# EAGLE schematic BRD1001-003-320 - Switchboard (EAGLE 9.4.2)
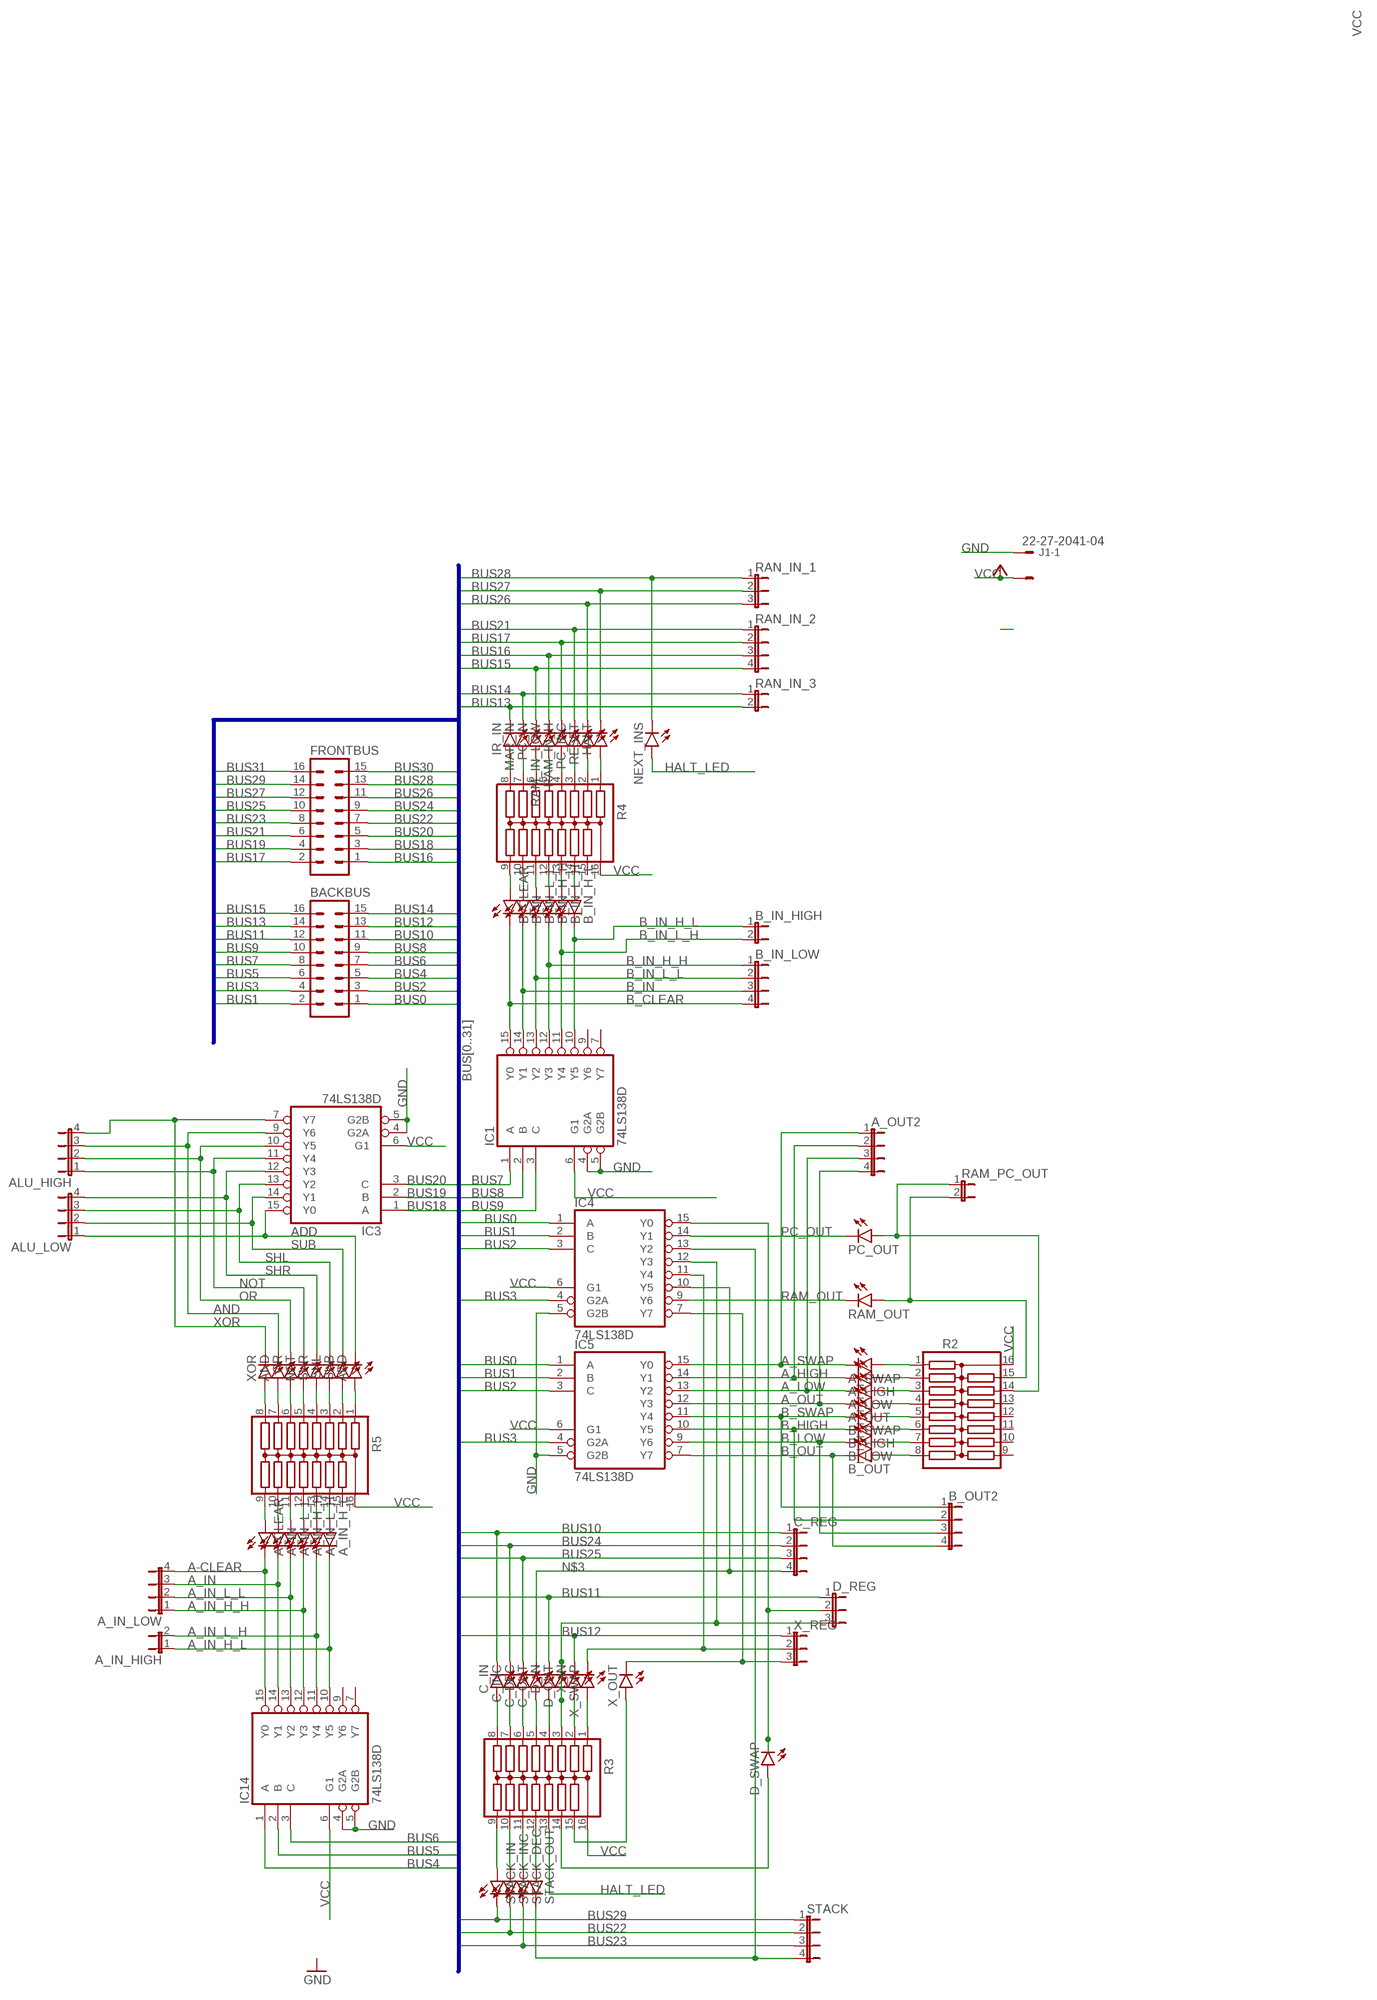
[diagram p0: schematic, sheet 1]

## Parts
A_CLEAR  LEDSFH482  [SFH482]
A_HIGH  LEDSFH482  [SFH482]
A_IN  LEDSFH482  [SFH482]
A_IN_H_H  LEDSFH482  [SFH482]
A_IN_H_L  LEDSFH482  [SFH482]
A_IN_HIGH  JP1E  [JP1]
A_IN_L_H  LEDSFH482  [SFH482]
A_IN_L_L  LEDSFH482  [SFH482]
A_IN_LOW  JP4E  [JP4]
A_LOW  LEDSFH482  [SFH482]
A_OUT  LEDSFH482  [SFH482]
A_OUT2  JP4E  [JP4]
A_SWAP  LEDSFH482  [SFH482]
ADD  LEDSFH482  [SFH482]
ALU_HIGH  JP4E  [JP4]
ALU_LOW  JP4E  [JP4]
AND  LEDSFH482  [SFH482]
B_CLEAR  LEDSFH482  [SFH482]
B_HIGH  LEDSFH482  [SFH482]
B_IN  LEDSFH482  [SFH482]
B_IN_H_H  LEDSFH482  [SFH482]
B_IN_H_L  LEDSFH482  [SFH482]
B_IN_HIGH  JP1E  [JP1]
B_IN_L_H  LEDSFH482  [SFH482]
B_IN_L_L  LEDSFH482  [SFH482]
B_IN_LOW  JP4E  [JP4]
B_LOW  LEDSFH482  [SFH482]
B_OUT  LEDSFH482  [SFH482]
B_OUT2  JP4E  [JP4]
B_SWAP  LEDSFH482  [SFH482]
BACKBUS  ML16  [ML16]
C_DEC  LEDSFH482  [SFH482]
C_IN  LEDSFH482  [SFH482]
C_INC  LEDSFH482  [SFH482]
C_OUT  LEDSFH482  [SFH482]
C_REG  JP4E  [JP4]
D_IN  LEDSFH482  [SFH482]
D_OUT  LEDSFH482  [SFH482]
D_REG  JP2W  [JP2W]
D_SWAP  LEDSFH482  [SFH482]
FRONTBUS  ML16  [ML16]
HALT  LEDSFH482  [SFH482]
IC1  74LS138D  [SO16]
IC3  74LS138D  [SO16]
IC4  74LS138D  [SO16]
IC5  74LS138D  [SO16]
IC14  74LS138D  [SO16]
IR_IN  LEDSFH482  [SFH482]
J1  22-27-2041-04  [6410-04]
MAR_IN  LEDSFH482  [SFH482]
NEXT_INS  LEDSFH482  [SFH482]
NOT  LEDSFH482  [SFH482]
OR  LEDSFH482  [SFH482]
PC_IN  LEDSFH482  [SFH482]
PC_INC  LEDSFH482  [SFH482]
PC_OUT  LEDSFH482  [SFH482]
R2  2NBS16-15  [SO16]
R3  2NBS16-15  [SO16]
R4  2NBS16-15  [SO16]
R5  2NBS16-15  [SO16]
RAM_IN_H  LEDSFH482  [SFH482]
RAM_IN_LOW  LEDSFH482  [SFH482]
RAM_OUT  LEDSFH482  [SFH482]
RAM_PC_OUT  JP1E  [JP1]
RAN_IN_1  JP2W  [JP2W]
RAN_IN_2  JP4E  [JP4]
RAN_IN_3  JP1E  [JP1]
RESET  LEDSFH482  [SFH482]
SHL  LEDSFH482  [SFH482]
SHR  LEDSFH482  [SFH482]
STACK  JP4E  [JP4]
STACK_DEC  LEDSFH482  [SFH482]
STACK_IN  LEDSFH482  [SFH482]
STACK_INC  LEDSFH482  [SFH482]
STACK_OUT  LEDSFH482  [SFH482]
SUB  LEDSFH482  [SFH482]
X_IN  LEDSFH482  [SFH482]
X_OUT  LEDSFH482  [SFH482]
X_REG  JP2W  [JP2W]
X_SWAP  LEDSFH482  [SFH482]
XOR  LEDSFH482  [SFH482]

## Nets
A-CLEAR: A_CLEAR.K(C) A_IN_LOW.4 IC14.15(Y0)
A_HIGH: A_HIGH.K(C) A_OUT2.2 IC5.14(Y1)
A_IN: A_IN.K(C) A_IN_LOW.3 IC14.14(Y1)
A_IN_H_H: A_IN_H_H.K(C) A_IN_LOW.1 IC14.12(Y3)
A_IN_H_L: A_IN_H_L.K(C) A_IN_HIGH.1 IC14.10(Y5)
A_IN_L_H: A_IN_HIGH.2 A_IN_L_H.K(C) IC14.11(Y4)
A_IN_L_L: A_IN_L_L.K(C) A_IN_LOW.2 IC14.13(Y2)
A_LOW: A_LOW.K(C) A_OUT2.3 IC5.13(Y2)
A_OUT: A_OUT2.4 A_OUT.K(C) IC5.12(Y3)
A_SWAP: A_OUT2.1 A_SWAP.K(C) IC5.15(Y0)
ADD: ADD.K(C) ALU_LOW.1 IC3.15(Y0)
AND: ALU_HIGH.3 AND.K(C) IC3.9(Y6)
B_CLEAR: B_CLEAR.K(C) B_IN_LOW.4 IC1.15(Y0)
B_HIGH: B_HIGH.K(C) B_OUT2.2 IC5.10(Y5)
B_IN: B_IN.K(C) B_IN_LOW.3 IC1.14(Y1)
B_IN_H_H: B_IN_H_H.K(C) B_IN_LOW.1 IC1.12(Y3)
B_IN_H_L: B_IN_H_L.K(C) B_IN_HIGH.1 IC1.10(Y5)
B_IN_L_H: B_IN_HIGH.2 B_IN_L_H.K(C) IC1.11(Y4)
B_IN_L_L: B_IN_L_L.K(C) B_IN_LOW.2 IC1.13(Y2)
B_LOW: B_LOW.K(C) B_OUT2.3 IC5.9(Y6)
B_OUT: B_OUT2.4 B_OUT.K(C) IC5.7(Y7)
B_SWAP: B_OUT2.1 B_SWAP.K(C) IC5.11(Y4)
BUS0: BACKBUS.1 IC4.1(A) IC5.1(A)
BUS1: BACKBUS.2 IC4.2(B) IC5.2(B)
BUS2: BACKBUS.3 IC4.3(C) IC5.3(C)
BUS3: BACKBUS.4 IC4.4(G2A) IC5.4(G2A)
BUS4: BACKBUS.5 IC14.1(A)
BUS5: BACKBUS.6 IC14.2(B)
BUS6: BACKBUS.7 IC14.3(C)
BUS7: BACKBUS.8 IC1.1(A)
BUS8: BACKBUS.9 IC1.2(B)
BUS9: BACKBUS.10 IC1.3(C)
BUS10: BACKBUS.11 C_IN.K(C) C_REG.1
BUS11: BACKBUS.12 D_IN.K(C) D_REG.1
BUS12: BACKBUS.13 X_IN.K(C) X_REG.1
BUS13: BACKBUS.14 IR_IN.K(C) RAN_IN_3.2
BUS14: BACKBUS.15 MAR_IN.K(C) RAN_IN_3.1
BUS15: BACKBUS.16 PC_IN.K(C) RAN_IN_2.4
BUS16: FRONTBUS.1 RAM_IN_LOW.K(C) RAN_IN_2.3
BUS17: FRONTBUS.2 RAM_IN_H.K(C) RAN_IN_2.2
BUS18: FRONTBUS.3 IC3.1(A)
BUS19: FRONTBUS.4 IC3.2(B)
BUS20: FRONTBUS.5 IC3.3(C)
BUS21: FRONTBUS.6 PC_INC.K(C) RAN_IN_2.1
BUS22: FRONTBUS.7 STACK.2 STACK_INC.K(C)
BUS23: FRONTBUS.8 STACK.3 STACK_DEC.K(C)
BUS24: C_INC.K(C) C_REG.2 FRONTBUS.9
BUS25: C_DEC.K(C) C_REG.3 FRONTBUS.10
BUS26: FRONTBUS.11 RAN_IN_1.3 RESET.K(C)
BUS27: FRONTBUS.12 HALT.K(C) RAN_IN_1.2
BUS28: FRONTBUS.13 NEXT_INS.K(C) RAN_IN_1.1
BUS29: FRONTBUS.14 STACK.1 STACK_IN.K(C)
BUS30: FRONTBUS.15
BUS31: FRONTBUS.16
GND: IC1.4(G2A) IC1.5(G2B) IC3.4(G2A) IC3.5(G2B) IC4.5(G2B) IC5.5(G2B) IC14.4(G2A) IC14.5(G2B) J1.1
HALT_LED: NEXT_INS.A R3.13
N$2: C_IN.A R3.8
N$3: C_OUT.K(C) C_REG.4 IC4.10(Y5)
N$4: C_OUT.A R3.5
N$5: C_DEC.A R3.6
N$6: C_INC.A R3.7
N$7: D_OUT.A D_OUT.K(C) D_REG.3 IC4.12(Y3) R3.3
N$8: D_IN.A R3.4
N$9: R3.1 X_SWAP.A
N$10: IC4.11(Y4) X_REG.2 X_SWAP.K(C)
N$11: R3.2 X_IN.A
N$12: IC4.7(Y7) X_OUT.K(C) X_REG.3
N$13: R3.15 X_OUT.A
N$14: R3.9 STACK_IN.A
N$15: R3.10 STACK_INC.A
N$16: R3.11 STACK_DEC.A
N$17: R3.12 STACK_OUT.A
N$18: IC4.13(Y2) STACK.4 STACK_OUT.K(C)
N$19: D_REG.2 D_SWAP.K(C) IC4.15(Y0)
N$20: D_SWAP.A R3.14
N$21: A_CLEAR.A R5.9
N$22: ADD.A R5.1
N$23: A_IN.A R5.10
N$24: B_CLEAR.A R4.9
N$25: B_IN.A R4.10
N$26: B_IN_L_L.A R4.11
N$27: B_IN_H_H.A R4.12
N$28: R5.8 XOR.A
N$29: AND.A R5.7
N$30: OR.A R5.6
N$31: NOT.A R5.5
N$32: R5.4 SHR.A
N$33: R5.3 SHL.A
N$34: R5.2 SUB.A
N$35: B_IN_L_H.A R4.13
N$36: B_IN_H_L.A R4.14
N$38: A_IN_L_L.A R5.11
N$39: A_IN_H_H.A R5.12
N$40: A_IN_L_H.A R5.13
N$41: A_IN_H_L.A R5.14
N$44: R2.15 RAM_OUT.A RAM_PC_OUT.2
N$45: A_SWAP.A R2.1
N$46: A_HIGH.A R2.2
N$47: A_LOW.A R2.3
N$48: A_OUT.A R2.4
N$49: B_SWAP.A R2.5
N$51: B_HIGH.A R2.6
N$52: B_LOW.A R2.7
N$53: B_OUT.A R2.8
N$54: PC_OUT.A R2.14 RAM_PC_OUT.1
N$55: IR_IN.A R4.8
N$56: MAR_IN.A R4.7
N$57: PC_IN.A R4.6
N$58: R4.5 RAM_IN_LOW.A
N$59: R4.4 RAM_IN_H.A
N$60: PC_INC.A R4.3
N$61: R4.2 RESET.A
N$62: HALT.A R4.1
NOT: ALU_HIGH.1 IC3.11(Y4) NOT.K(C)
OR: ALU_HIGH.2 IC3.10(Y5) OR.K(C)
PC_OUT: IC4.14(Y1) PC_OUT.K(C)
RAM_OUT: IC4.9(Y6) RAM_OUT.K(C)
SHL: ALU_LOW.3 IC3.13(Y2) SHL.K(C)
SHR: ALU_LOW.4 IC3.12(Y3) SHR.K(C)
SUB: ALU_LOW.2 IC3.14(Y1) SUB.K(C)
VCC: IC1.6(G1) IC3.6(G1) IC4.6(G1) IC5.6(G1) IC14.6(G1) J1.2 R2.16 R3.16 R4.16 R5.16
XOR: ALU_HIGH.4 IC3.7(Y7) XOR.K(C)
Unconnected: IC1.7(Y7) IC1.9(Y6) IC14.7(Y7) IC14.9(Y6) J1.3 J1.4 R2.9 R2.10 R2.11 R2.12 R2.13 R4.15 R5.15

## Buses
BUS[0..31]

## Power pins joined to a net without a drawn wire
GND: IC1.8(GND) IC3.8(GND) IC4.8(GND) IC5.8(GND) IC14.8(GND)
VCC: IC1.16(VCC) IC3.16(VCC) IC4.16(VCC) IC5.16(VCC) IC14.16(VCC)

## Library data of the parts
A_CLEAR A_HIGH A_IN A_IN_H_H A_IN_H_L A_IN_L_H A_IN_L_L A_LOW A_OUT A_SWAP ADD AND B_CLEAR B_HIGH B_IN B_IN_H_H B_IN_H_L B_IN_L_H B_IN_L_L B_LOW B_OUT B_SWAP C_DEC C_IN C_INC C_OUT D_IN D_OUT D_SWAP HALT IR_IN MAR_IN NEXT_INS NOT OR PC_IN PC_INC PC_OUT RAM_IN_H RAM_IN_LOW RAM_OUT RESET SHL SHR STACK_DEC STACK_IN STACK_INC STACK_OUT SUB X_IN X_OUT X_SWAP XOR = led:LED: LED OSRAM: - CHIPLED LG R971, LG N971, LY N971, LG Q971, LY Q971, LO R971, LY R971 LH N974, LH R974 LS Q976, LO Q976, LY Q976 LO Q996 - Hyper CHIPLED LW Q18S LB Q993, LB Q99A, LB R99A - SideLED LS A670, LO A670, LY A670, LG A670, LP A670 LB A673, LV A673, LT A673, LW A673 LH A674 LY A675 LS A676, LA A676, LO A676, LY A676, LW A676 LS A679, LY A679, LG A679 - Hyper Micro SIDELED® LS Y876, LA Y876, LO Y876, LY Y876 LT Y87S - SmartLED LW L88C, LW L88S LB L89C, LB L89S, LG L890 LS L89K, LO L89K, LY L89K LS L896, LA L896, LO L896, LY L896 - TOPLED LS T670, LO T670, LY T670, LG T670, LP T670 LSG T670, LSP T670, LSY T670, LOP T670, LYG T670 LG T671, LOG T671, LSG T671 LB T673, LV T673, LT T673, LW T673 LH T674 LS T676, LA T676, LO T676, LY T676, LB T676, LH T676, LSB T676, LW T676 LB T67C, LV T67C, LT T67C, LS T67K, LO T67K, LY T67K, LW E67C LS E67B, LA E67B, LO E67B, LY E67B, LB E67C, LV E67C, LT E67C LW T67C LS T679, LY T679, LG T679 LS T770, LO T770, LY T770, LG T770, LP T770 LB T773, LV T773, LT T773, LW T773 LH T774 LS E675, LA E675, LY E675, LS T675 LS T776, LA T776, LO T776, LY T776, LB T776 LHGB T686 LT T68C, LB T68C - Hyper Mini TOPLED® LB M676 - Mini TOPLED Santana® LG M470 LS M47K, LO M47K, LY M47K Source: http://www.osram.convergy.de LUXEON: - LUMILED® LXK2-PW12-R00, LXK2-PW12-S00, LXK2-PW14-U00, LXK2-PW14-V00 LXK2-PM12-R00, LXK2-PM12-S00, LXK2-PM14-U00 LXK2-PE12-Q00, LXK2-PE12-R00, LXK2-PE12-S00, LXK2-PE14-T00, LXK2-PE14-U00 LXK2-PB12-K00, LXK2-PB12-L00, LXK2-PB12-M00, LXK2-PB14-N00, LXK2-PB14-P00, LXK2-PB14-Q00 LXK2-PR12-L00, LXK2-PR12-M00, LXK2-PR14-Q00, LXK2-PR14-R00 LXK2-PD12-Q00, LXK2-PD12-R00, LXK2-PD12-S00 LXK2-PH12-R00, LXK2-PH12-S00 LXK2-PL12-P00, LXK2-PL12-Q00, LXK2-PL12-R00 Source: www.luxeon.com KINGBRIGHT: KA-3528ASYC Source: www.kingbright.com
A_IN_HIGH B_IN_HIGH RAM_PC_OUT RAN_IN_3 = jumper:JP1E: JUMPER
A_IN_LOW A_OUT2 ALU_HIGH ALU_LOW B_IN_LOW B_OUT2 C_REG RAN_IN_2 STACK = jumper:JP4E: JUMPER
BACKBUS FRONTBUS = con-harting-ml:ML16: HARTING; OC_FARNELL: unknown; OC_NEWARK: unknown
D_REG RAN_IN_1 X_REG = jumper:JP2W: JUMPER
IC1 IC3-IC5 IC14 = 74xx-us:74*138: 3-line to 8-line DECODER/DEMULTIPLEXER
J1 = con-molex:22-?-04: CONNECTOR wire to board 2.54 mm (.1 inch) pitch header; MF: MOLEX; OC_FARNELL: unknown; OC_NEWARK: unknown
R2-R5 = resistor-bourns:2NBS16-15: BOURNS RESISTOR NETWORK; OC_FARNELL: unknown; OC_NEWARK: unknown